# Altium schematic sheet Con_vga_db15.schdoc: Video Out Connector
size A4; DocumentNumber: 17; SheetNumber: 18; SheetTotal: 77
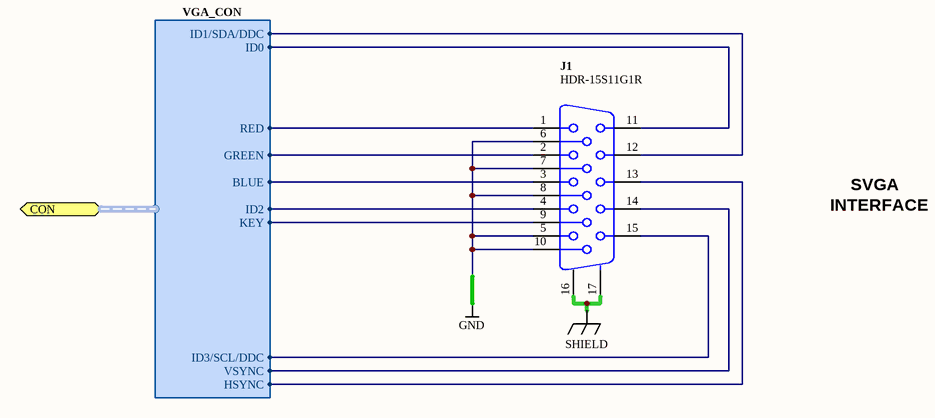
[diagram p0: Con_vga_db15.schdoc]

## Parts
J1  HDR-15S11G1R  [DB15-VGA-Female]

## Ports
CON (harness VGA_CON)

## Harnesses
VGA_CON: RED, GREEN, BLUE, VSYNC, HSYNC, KEY, ID2, ID3/SCL/DDC, ID1/SDA/DDC, ID0

## Nets
GND: J1.5 J1.6 J1.7 J1.8 J1.10
SHIELD: J1.16(MH1) J1.17(MH2)
NetJ1_1: J1.1 ; port CON.RED
NetJ1_2: J1.2 ; port CON.GREEN
NetJ1_3: J1.3 ; port CON.BLUE
NetJ1_4: J1.4 ; port CON.ID2
NetJ1_9: J1.9 ; port CON.KEY
NetJ1_11: J1.11 ; port CON.ID0
NetJ1_12: J1.12 ; port CON.ID1/SDA/DDC
NetJ1_13: J1.13 ; port CON.HSYNC
NetJ1_14: J1.14 ; port CON.VSYNC
NetJ1_15: J1.15 ; port CON.ID3/SCL/DDC

## Notes on the sheet
- INTERFACE
- SVGA
- Sheet Title
- Project Title
- Size:
- Date:
- A4
- Assy:
- Time:
- Revision:
- Sheet
- of
- File:

## Library data of the parts
J1 = D-300-0121: Socket, High-Density DB15 (HD15) R/A Female Through-hole; Connector type: Right Angle; Max Current: 3 A; Category: Connector; Mounting Technology: Through-Hole; Pin Count: 15; Status: Unreleased